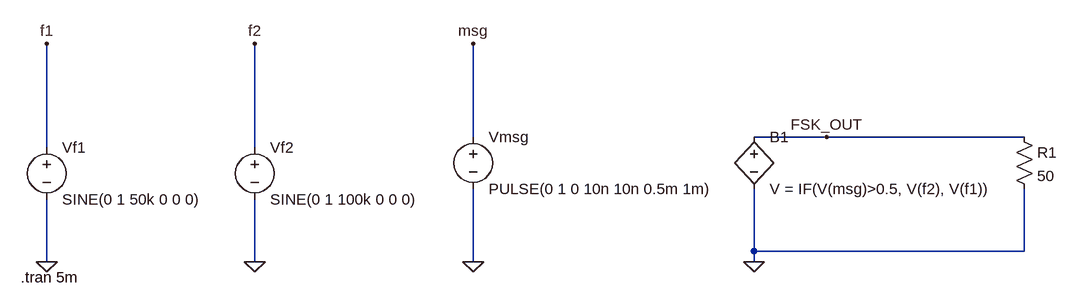
[diagram p0: schematic FSK (exp 10).asc]
FSK (exp 10).asc, the LTspice schematic file:
Version 4.1
SHEET 1 1640 680
WIRE 736 128 736 -16
WIRE 1280 128 1168 128
WIRE 1584 128 1280 128
WIRE 80 144 80 -16
WIRE 400 144 400 -16
WIRE 1168 304 1168 208
WIRE 1584 304 1584 208
WIRE 1584 304 1168 304
WIRE 80 320 80 224
WIRE 400 320 400 224
WIRE 736 320 736 208
WIRE 1168 320 1168 304
FLAG 80 320 0
FLAG 80 -16 f1
FLAG 400 320 0
FLAG 400 -16 f2
FLAG 736 320 0
FLAG 736 -16 msg
FLAG 1168 320 0
FLAG 1280 128 FSK_OUT
SYMBOL voltage 80 128 R0
WINDOW 123 0 0 Left 0
WINDOW 39 0 0 Left 0
SYMATTR InstName Vf1
SYMATTR Value SINE(0 1 50k 0 0 0)
SYMBOL voltage 400 128 R0
WINDOW 123 0 0 Left 0
WINDOW 39 0 0 Left 0
SYMATTR InstName Vf2
SYMATTR Value SINE(0 1 100k 0 0 0)
SYMBOL voltage 736 112 R0
WINDOW 123 0 0 Left 0
WINDOW 39 0 0 Left 0
SYMATTR InstName Vmsg
SYMATTR Value PULSE(0 1 0 10n 10n 0.5m 1m)
SYMBOL bv 1168 112 R0
SYMATTR InstName B1
SYMATTR Value V = IF(V(msg)>0.5, V(f2), V(f1))
SYMBOL res 1568 112 R0
SYMATTR InstName R1
SYMATTR Value 50
TEXT 40 344 Left 2 !.tran 5m

The netlist it stands for:
* FSK (exp 10).asc
Vf1 f1 0 SINE(0 1 50k 0 0 0)
Vf2 f2 0 SINE(0 1 100k 0 0 0)
Vmsg msg 0 PULSE(0 1 0 10n 10n 0.5m 1m)
B1 FSK_OUT 0 V = IF(V(msg)>0.5, V(f2), V(f1))
R1 FSK_OUT 0 50
.tran 5m
.backanno
.end